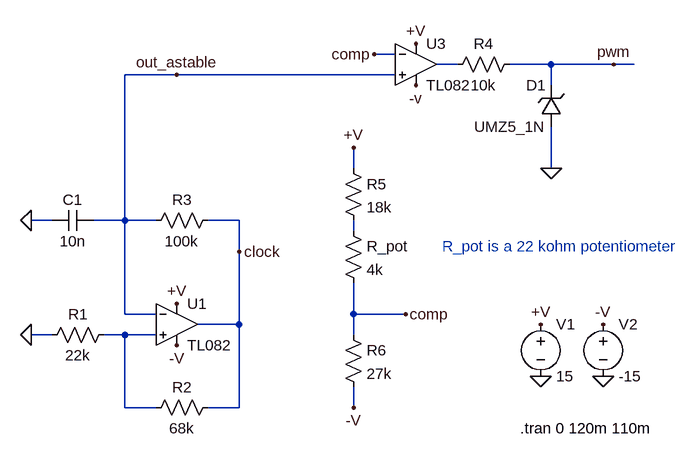
[diagram p0: schematic pwm_generator_astable_cell.asc]
pwm_generator_astable_cell.asc, the LTspice schematic file:
Version 4
SHEET 1 1376 680
WIRE 528 -304 496 -304
WIRE 624 -288 592 -288
WIRE 768 -288 704 -288
WIRE 864 -288 768 -288
WIRE 896 -288 864 -288
WIRE 192 -272 112 -272
WIRE 528 -272 192 -272
WIRE 768 -256 768 -288
WIRE 464 -128 464 -160
WIRE 768 -128 768 -192
WIRE 0 -48 -32 -48
WIRE 112 -48 112 -272
WIRE 112 -48 64 -48
WIRE 160 -48 112 -48
WIRE 288 -48 240 -48
WIRE 464 -32 464 -48
WIRE 288 0 288 -48
WIRE 112 96 112 -48
WIRE 160 96 112 96
WIRE 464 96 464 48
WIRE 544 96 464 96
WIRE 288 112 288 0
WIRE 288 112 224 112
WIRE 0 128 -32 128
WIRE 112 128 80 128
WIRE 160 128 112 128
WIRE 464 128 464 96
WIRE 112 240 112 128
WIRE 160 240 112 240
WIRE 288 240 288 112
WIRE 288 240 240 240
WIRE 464 240 464 208
FLAG 192 80 +V
FLAG 752 112 +V
FLAG 848 112 -V
FLAG 192 144 -V
FLAG 752 192 0
FLAG 848 192 0
FLAG -32 -48 0
FLAG -32 128 0
FLAG 192 -272 out_astable
FLAG 560 -320 +V
FLAG 560 -256 -v
FLAG 288 0 clock
FLAG 464 -160 +V
FLAG 544 96 comp
FLAG 496 -304 comp
FLAG 464 240 -V
FLAG 768 -128 0
FLAG 864 -288 pwm
SYMBOL TL082 192 112 R0
SYMATTR InstName U1
SYMBOL voltage 752 96 R0
WINDOW 123 0 0 Left 0
WINDOW 39 0 0 Left 0
SYMATTR InstName V1
SYMATTR Value 15
SYMBOL voltage 848 96 R0
WINDOW 123 0 0 Left 0
WINDOW 39 0 0 Left 0
SYMATTR InstName V2
SYMATTR Value -15
SYMBOL res 96 112 R90
WINDOW 0 0 56 VBottom 2
WINDOW 3 32 56 VTop 2
SYMATTR InstName R1
SYMATTR Value 22k
SYMBOL res 256 224 R90
WINDOW 0 0 56 VBottom 2
WINDOW 3 32 56 VTop 2
SYMATTR InstName R2
SYMATTR Value 68k
SYMBOL res 256 -64 R90
WINDOW 0 0 56 VBottom 2
WINDOW 3 32 56 VTop 2
SYMATTR InstName R3
SYMATTR Value 100k
SYMBOL cap 0 -32 R270
WINDOW 0 32 32 VTop 2
WINDOW 3 0 32 VBottom 2
SYMATTR InstName C1
SYMATTR Value 10n
SYMBOL TL082 560 -288 R0
SYMATTR InstName U3
SYMBOL res 448 -144 R0
SYMATTR InstName R5
SYMATTR Value 18k
SYMBOL res 448 112 R0
SYMATTR InstName R6
SYMATTR Value 27k
SYMBOL res 720 -304 R90
WINDOW 0 0 56 VBottom 2
WINDOW 3 32 56 VTop 2
SYMATTR InstName R4
SYMATTR Value 10k
SYMBOL zener 784 -192 R180
WINDOW 0 24 64 Left 2
WINDOW 3 24 0 Left 2
SYMATTR InstName D1
SYMATTR Value UMZ5_1N
SYMATTR Description Diode
SYMATTR Type diode
SYMBOL res 448 -48 R0
SYMATTR InstName R_pot
SYMATTR Value 4k
TEXT 720 272 Left 2 !.tran 0 120m 110m
TEXT 600 -8 Left 2 ;R_pot is a 22 kohm potentiometer

The netlist it stands for:
* pwm_generator_astable_cell.asc
* U1: TL082 (symbol TL082 not available, pins judged from their places): In+=N003 In-=out_astable V+=+V V-=-V OUT=clock
V1 +V 0 15
V2 -V 0 -15
R1 N003 0 22k
R2 clock N003 68k
R3 clock out_astable 100k
C1 0 out_astable 10n
* U3: TL082 (symbol TL082 not available, pins judged from their places): In+=out_astable In-=comp V+=+V V-=-V OUT=N001
R5 +V N002 18k
R6 comp -V 27k
R4 pwm N001 10k
D1 0 pwm UMZ5_1N
R_pot N002 comp 4k
.model D D
.lib standard.dio
.tran 0 120m 110m
* R_pot is a 22 kohm potentiometer
.backanno
.end